# EAGLE design 506_outin_raspberrypi_zero (EAGLE 7.4.0)
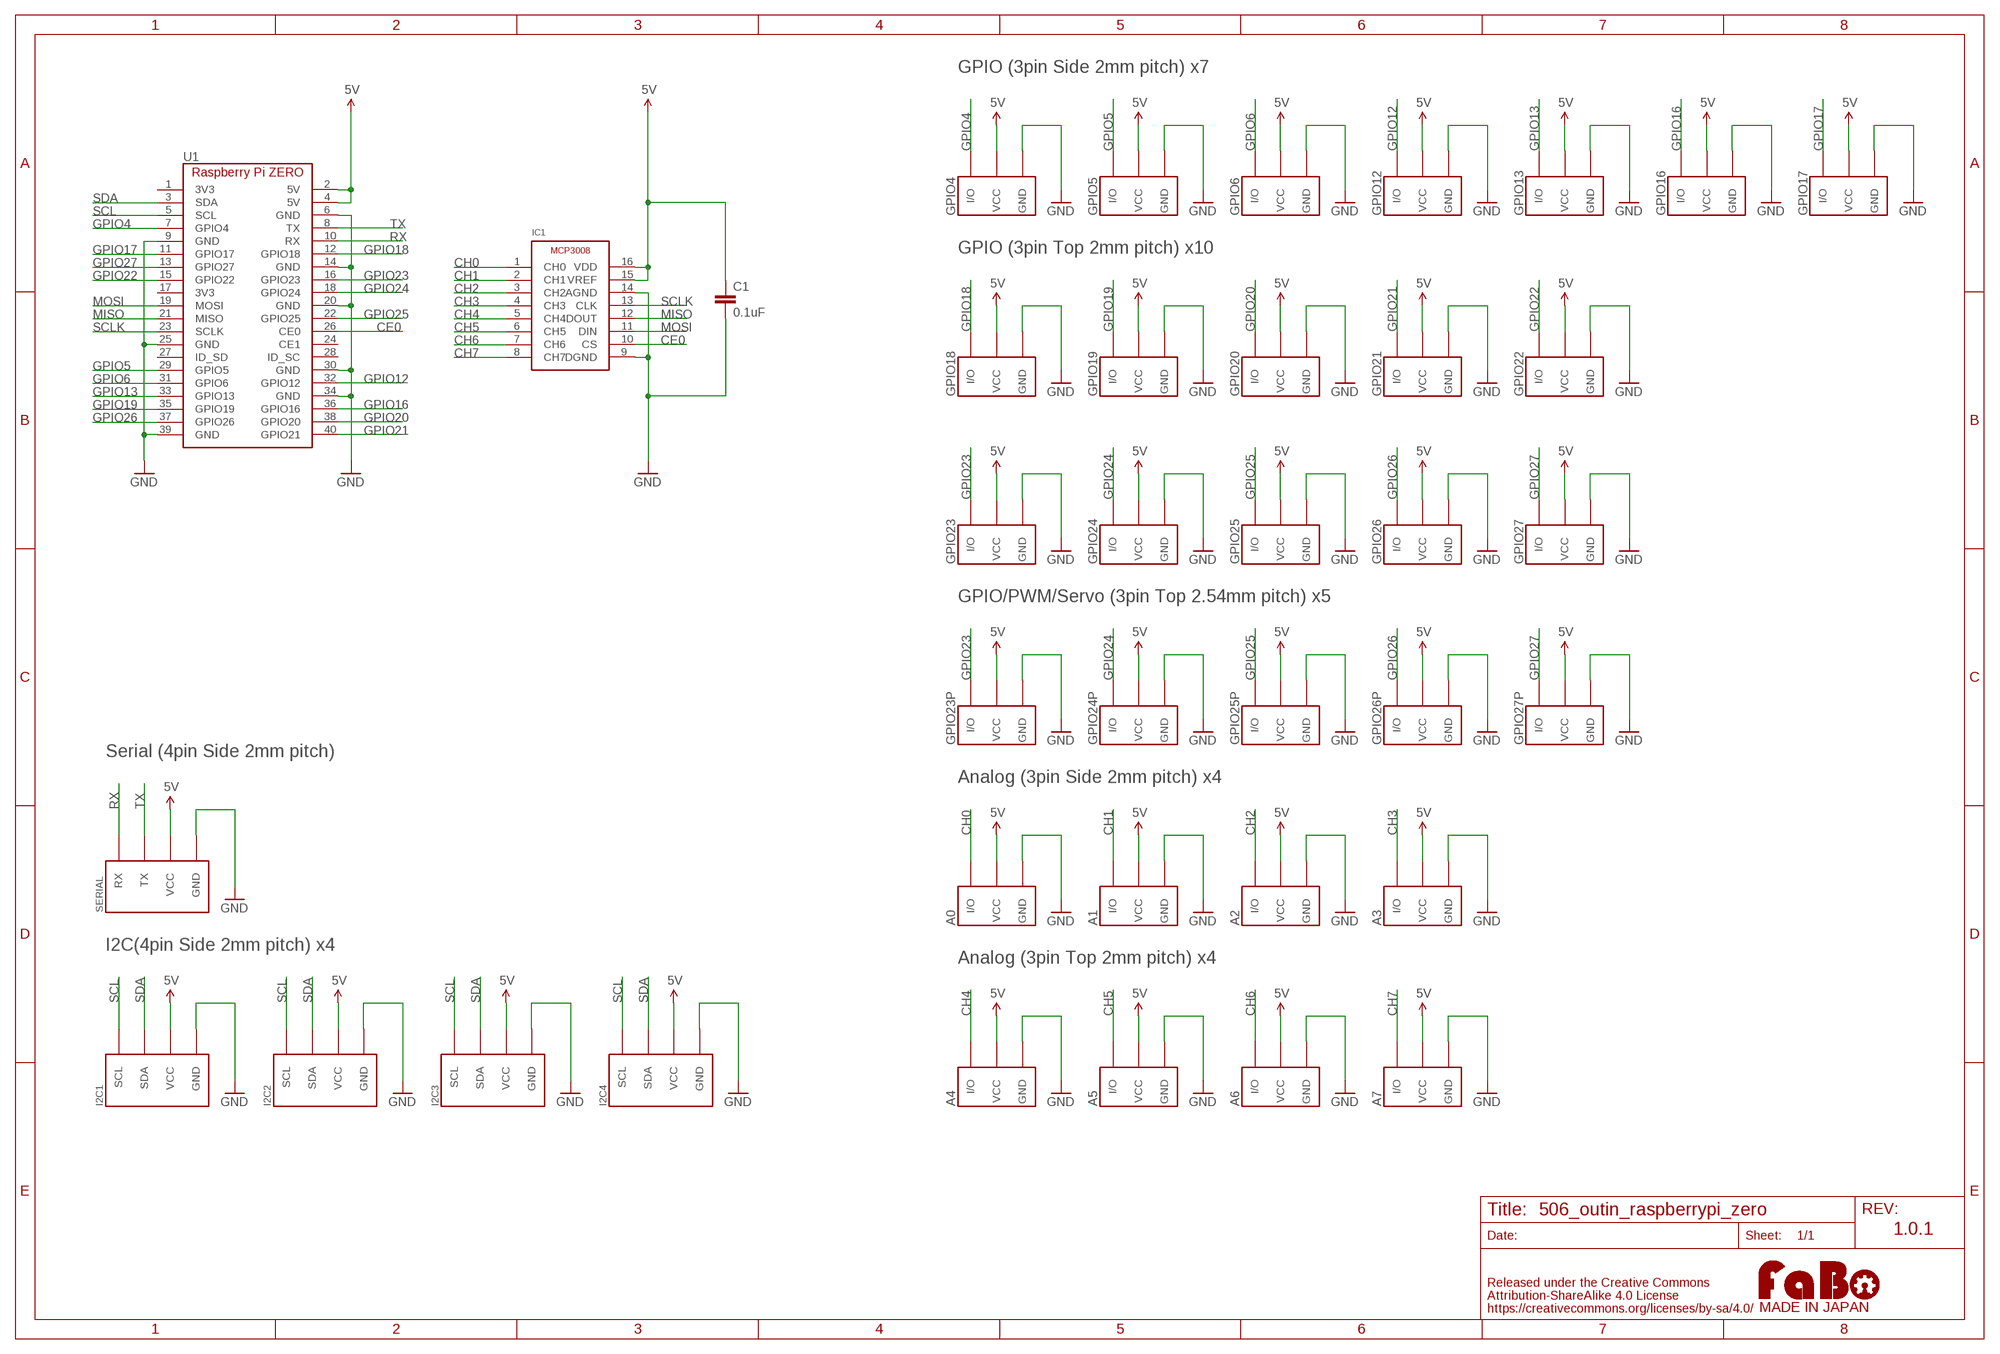
[diagram p0: schematic, sheet 1]

## Parts
A0  FABO_BRICK_3PIN-S03B-PASK-2  [FABO_BRICK_3PIN_S03B-PASK-2]
A1  FABO_BRICK_3PIN-S03B-PASK-2  [FABO_BRICK_3PIN_S03B-PASK-2]
A2  FABO_BRICK_3PIN-S03B-PASK-2  [FABO_BRICK_3PIN_S03B-PASK-2]
A3  FABO_BRICK_3PIN-S03B-PASK-2  [FABO_BRICK_3PIN_S03B-PASK-2]
A4  FABO_BRICK_3PIN-B03B-PASK-1  [FABO_BRICK_3PIN_B03B-PASK-1]
A5  FABO_BRICK_3PIN-B03B-PASK-1  [FABO_BRICK_3PIN_B03B-PASK-1]
A6  FABO_BRICK_3PIN-B03B-PASK-1  [FABO_BRICK_3PIN_B03B-PASK-1]
A7  FABO_BRICK_3PIN-B03B-PASK-1  [FABO_BRICK_3PIN_B03B-PASK-1]
C1  0.1uF  CAP-EIA0603  [EIA0603]
GPIO4  FABO_BRICK_3PIN-S03B-PASK-2  [FABO_BRICK_3PIN_S03B-PASK-2]
GPIO5  FABO_BRICK_3PIN-S03B-PASK-2  [FABO_BRICK_3PIN_S03B-PASK-2]
GPIO6  FABO_BRICK_3PIN-S03B-PASK-2  [FABO_BRICK_3PIN_S03B-PASK-2]
GPIO12  FABO_BRICK_3PIN-S03B-PASK-2  [FABO_BRICK_3PIN_S03B-PASK-2]
GPIO13  FABO_BRICK_3PIN-S03B-PASK-2  [FABO_BRICK_3PIN_S03B-PASK-2]
GPIO16  FABO_BRICK_3PIN-S03B-PASK-2  [FABO_BRICK_3PIN_S03B-PASK-2]
GPIO17  FABO_BRICK_3PIN-S03B-PASK-2  [FABO_BRICK_3PIN_S03B-PASK-2]
GPIO18  FABO_BRICK_3PIN-B03B-PASK-1  [FABO_BRICK_3PIN_B03B-PASK-1]
GPIO19  FABO_BRICK_3PIN-B03B-PASK-1  [FABO_BRICK_3PIN_B03B-PASK-1]
GPIO20  FABO_BRICK_3PIN-B03B-PASK-1  [FABO_BRICK_3PIN_B03B-PASK-1]
GPIO21  FABO_BRICK_3PIN-B03B-PASK-1  [FABO_BRICK_3PIN_B03B-PASK-1]
GPIO22  FABO_BRICK_3PIN-B03B-PASK-1  [FABO_BRICK_3PIN_B03B-PASK-1]
GPIO23  FABO_BRICK_3PIN-B03B-PASK-1  [FABO_BRICK_3PIN_B03B-PASK-1]
GPIO23P  FABO_BRICK_3PIN-HEADER  [FABO_BRICK_3PIN_HEADER]
GPIO24  FABO_BRICK_3PIN-B03B-PASK-1  [FABO_BRICK_3PIN_B03B-PASK-1]
GPIO24P  FABO_BRICK_3PIN-HEADER  [FABO_BRICK_3PIN_HEADER]
GPIO25  FABO_BRICK_3PIN-B03B-PASK-1  [FABO_BRICK_3PIN_B03B-PASK-1]
GPIO25P  FABO_BRICK_3PIN-HEADER  [FABO_BRICK_3PIN_HEADER]
GPIO26  FABO_BRICK_3PIN-B03B-PASK-1  [FABO_BRICK_3PIN_B03B-PASK-1]
GPIO26P  FABO_BRICK_3PIN-HEADER  [FABO_BRICK_3PIN_HEADER]
GPIO27  FABO_BRICK_3PIN-B03B-PASK-1  [FABO_BRICK_3PIN_B03B-PASK-1]
GPIO27P  FABO_BRICK_3PIN-HEADER  [FABO_BRICK_3PIN_HEADER]
I2C1  FABO_BRICK_I2C-S04B-PASK-2  [FABO_BRICK_I2C_S04B-PASK-2]
I2C2  FABO_BRICK_I2C-S04B-PASK-2  [FABO_BRICK_I2C_S04B-PASK-2]
I2C3  FABO_BRICK_I2C-S04B-PASK-2  [FABO_BRICK_I2C_S04B-PASK-2]
I2C4  FABO_BRICK_I2C-S04B-PASK-2  [FABO_BRICK_I2C_S04B-PASK-2]
IC1  MICROCHIP-MCP3008  [MICROCHIP-MCP3008]
SERIAL  FABO_BRICK_SERIAL-S04B-PASK-2  [FABO_BRICK_SERIAL_S04B-PASK-2]
U1  RASPBERRY_PI_ZERO  [RASPBERRY_PI_ZERO]
U$14  LOGO_FABO-M  [LOGO_FABO_MS]

## Nets
5V: A0.VCC A1.VCC A2.VCC A3.VCC A4.VCC A5.VCC A6.VCC A7.VCC C1.1 GPIO4.VCC GPIO5.VCC GPIO6.VCC GPIO12.VCC GPIO13.VCC GPIO16.VCC GPIO17.VCC GPIO18.VCC GPIO19.VCC GPIO20.VCC GPIO21.VCC GPIO22.VCC GPIO23.VCC GPIO23P.VCC GPIO24.VCC GPIO24P.VCC GPIO25.VCC GPIO25P.VCC GPIO26.VCC GPIO26P.VCC GPIO27.VCC GPIO27P.VCC I2C1.VCC I2C2.VCC I2C3.VCC I2C4.VCC IC1.15(VREF) IC1.16(VDD) SERIAL.VCC U1.2(5V) U1.4(5V)
CE0: IC1.10(CS) U1.26(CE0)
CH0: A0.I/O IC1.1(CH0)
CH1: A1.I/O IC1.2(CH1)
CH2: A2.I/O IC1.3(CH2)
CH3: A3.I/O IC1.4(CH3)
CH4: A4.I/O IC1.5(CH4)
CH5: A5.I/O IC1.6(CH5)
CH6: A6.I/O IC1.7(CH6)
CH7: A7.I/O IC1.8(CH7)
GND: A0.GND A1.GND A2.GND A3.GND A4.GND A5.GND A6.GND A7.GND C1.2 GPIO4.GND GPIO5.GND GPIO6.GND GPIO12.GND GPIO13.GND GPIO16.GND GPIO17.GND GPIO18.GND GPIO19.GND GPIO20.GND GPIO21.GND GPIO22.GND GPIO23.GND GPIO23P.GND GPIO24.GND GPIO24P.GND GPIO25.GND GPIO25P.GND GPIO26.GND GPIO26P.GND GPIO27.GND GPIO27P.GND I2C1.GND I2C2.GND I2C3.GND I2C4.GND IC1.9(DGND) IC1.14(AGND) SERIAL.GND U1.6(GND) U1.9(GND) U1.14(GND) U1.20(GND) U1.25(GND) U1.30(GND) U1.34(GND) U1.39(GND)
GPIO4: GPIO4.I/O U1.7(GPIO4)
GPIO5: GPIO5.I/O U1.29(GPIO5)
GPIO6: GPIO6.I/O U1.31(GPIO6)
GPIO12: GPIO12.I/O U1.32(GPIO12)
GPIO13: GPIO13.I/O U1.33(GPIO13)
GPIO16: GPIO16.I/O U1.36(GPIO16)
GPIO17: GPIO17.I/O U1.11(GPIO17)
GPIO18: GPIO18.I/O U1.12(GPIO18)
GPIO19: GPIO19.I/O U1.35(GPIO19)
GPIO20: GPIO20.I/O U1.38(GPIO20)
GPIO21: GPIO21.I/O U1.40(GPIO21)
GPIO22: GPIO22.I/O U1.15(GPIO22)
GPIO23: GPIO23.I/O GPIO23P.I/O U1.16(GPIO23)
GPIO24: GPIO24.I/O GPIO24P.I/O U1.18(GPIO24)
GPIO25: GPIO25.I/O GPIO25P.I/O U1.22(GPIO25)
GPIO26: GPIO26.I/O GPIO26P.I/O U1.37(GPIO26)
GPIO27: GPIO27.I/O GPIO27P.I/O U1.13(GPIO27)
MISO: IC1.12(DOUT) U1.21(MISO)
MOSI: IC1.11(DIN) U1.19(MOSI)
RX: SERIAL.RX U1.10(RX)
SCL: I2C1.SCL I2C2.SCL I2C3.SCL I2C4.SCL U1.5(SCL)
SCLK: IC1.13(CLK) U1.23(SCLK)
SDA: I2C1.SDA I2C2.SDA I2C3.SDA I2C4.SDA U1.3(SDA)
TX: SERIAL.TX U1.8(TX)
Unconnected: U1.1(3V3) U1.17(3V3) U1.24(CE1) U1.27(ID_SD) U1.28(ID_SC)

## Notes on the sheet
- GPIO (3pin Side 2mm pitch) x7
- GPIO (3pin Top 2mm pitch) x10
- GPIO/PWM/Servo (3pin Top 2.54mm pitch) x5
- Serial (4pin Side 2mm pitch)
- Analog (3pin Side 2mm pitch) x4
- I2C(4pin Side 2mm pitch) x4
- Analog (3pin Top 2mm pitch) x4
- 1.0.1

## Library data of the parts
A0 A1-A7 GPIO4-GPIO6 GPIO12 GPIO13 GPIO16-GPIO23 GPIO23P GPIO24 GPIO24P GPIO25 GPIO25P GPIO26 GPIO26P GPIO27 GPIO27P = FaBo-Template:FABO_BRICK_3PIN: FaBo Brick 3pin
C1 = FaBo-etc:CAP: Capacitor Standard 0603 ceramic capacitor
I2C1-I2C4 = FaBo-Template:FABO_BRICK_I2C: FaBo Brick I2C
IC1 = FaBo-ADC:MICROCHIP-MCP3008
SERIAL = FaBo-Template:FABO_BRICK_SERIAL: FaBo Brick Serial
U1 = FaBo-Boards:RASPBERRY_PI_ZERO
U$14 = FaBo-etc:LOGO_FABO

## Board
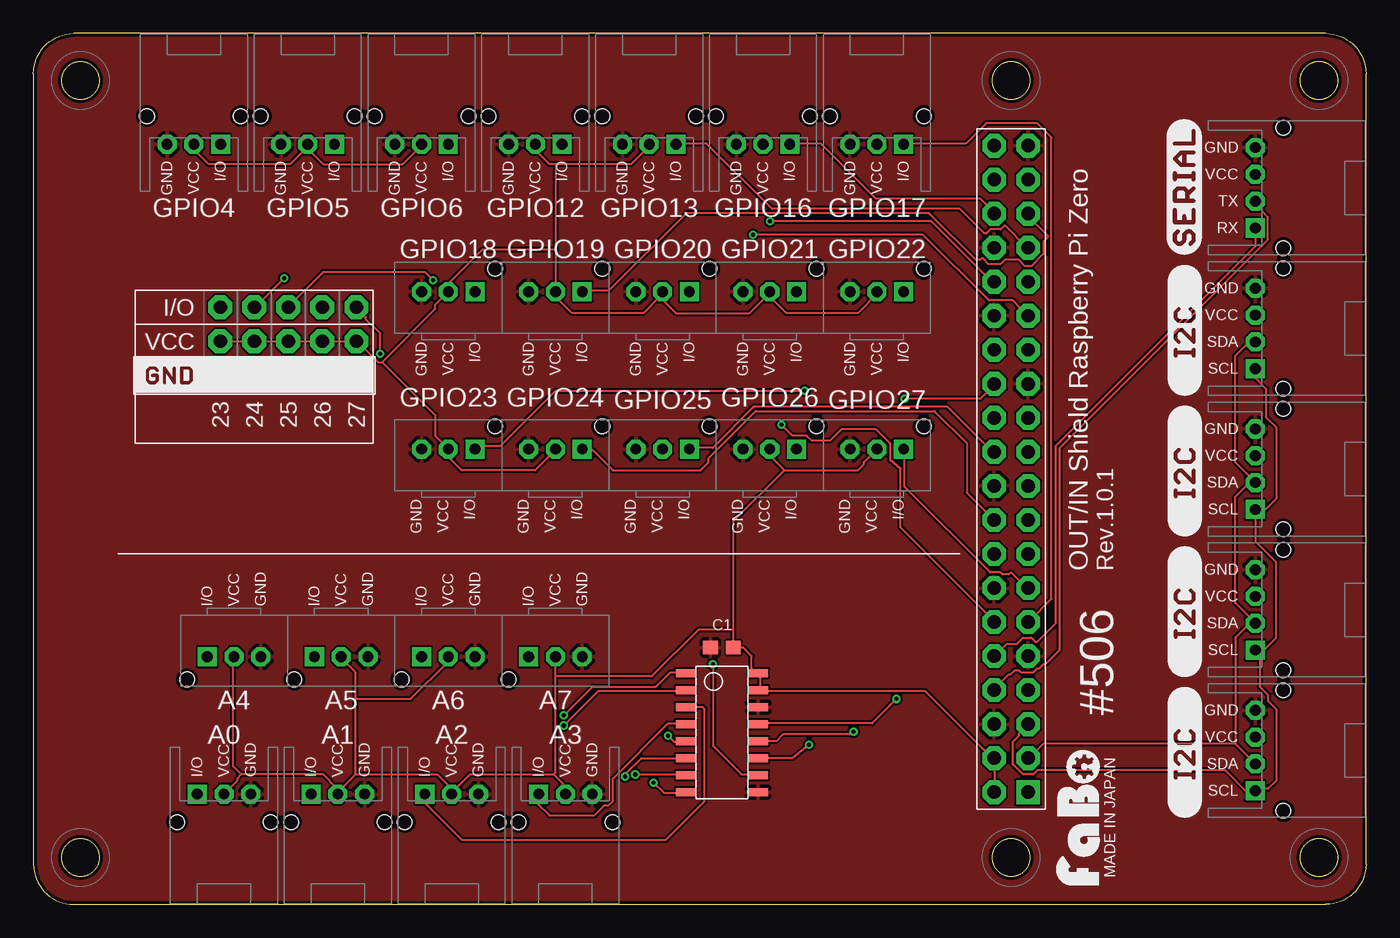
[diagram p1: board, top side]
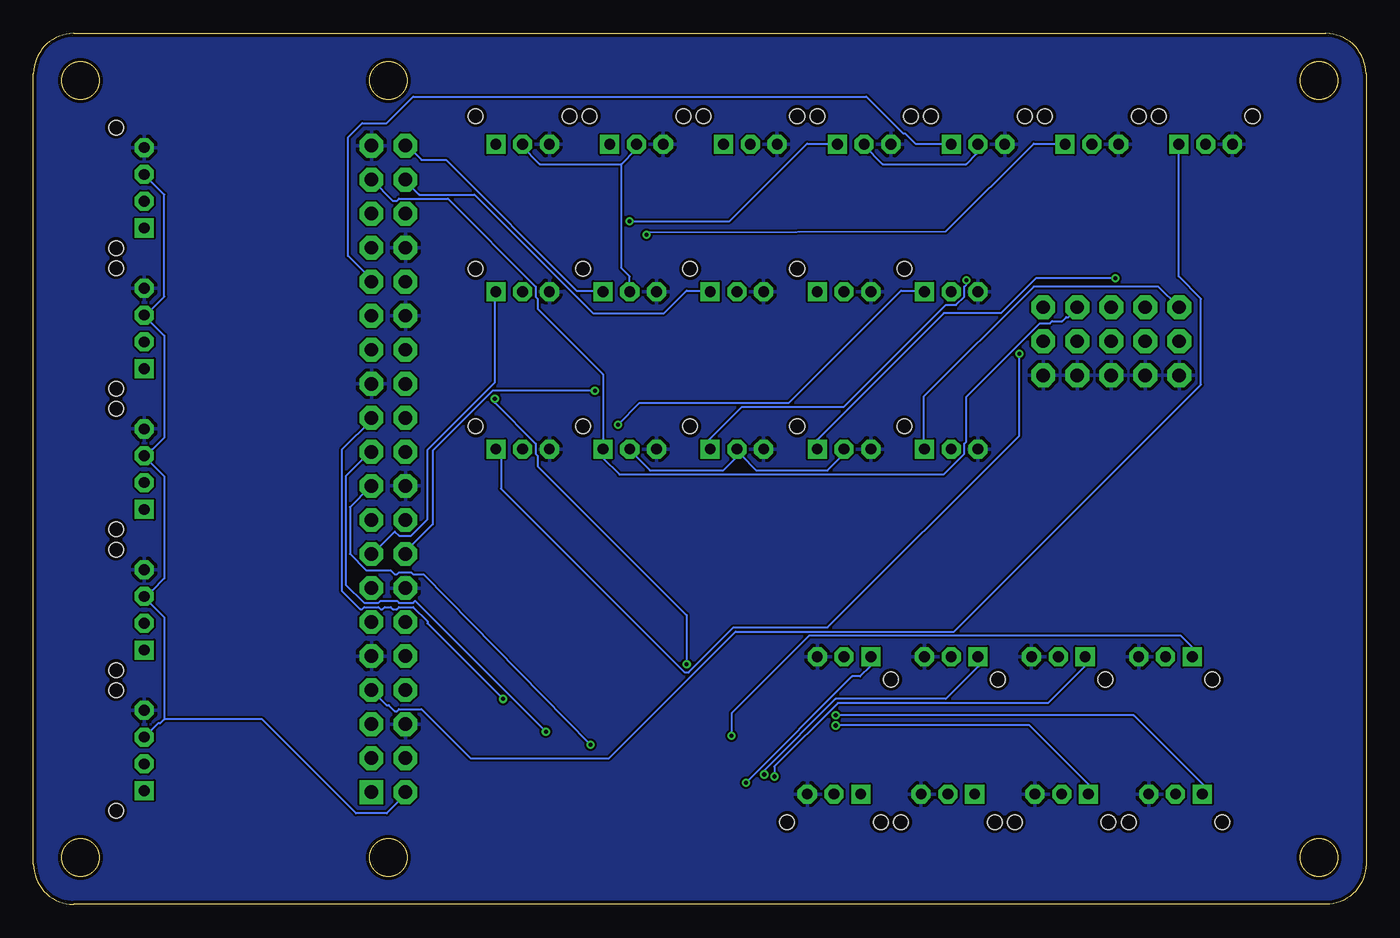
[diagram p2: board, bottom side, seen from below]

Size 99.5 x 65 mm. Coordinates in mm from the lower left corner, seen from the top.
Copper layers (1*16): Top 0.035mm / dielectric 1.5mm / Bottom 0.035mm
Design rules "Elecrow_2-layer_eagle_rule": minimum track width 6mil, minimum drill 12mil, track to track 6mil, track to pad 6mil, pad to pad 6mil, via to via 6mil, smd to smd 0mil, copper to edge 10mil, drill to drill 10mil, minimum pad ring 10mil, minimum via ring 6mil, stop-mask expansion 2mil, vias tented up to drill 100mil, thermal gap 10mil

### Footprints (pad centres in the part's own frame; a part is rotated, then mirrored left to right if it is on the bottom)
FABO_BRICK_3PIN_S03B-PASK-2 = drill 0.8 pad 1.422 octagon: GND -2,0; VCC 0,0 | drill 0.8 pad 1.422 square: I/O 2,0 | hole 1.1: 3.5,2.1; -3.5,2.1
FABO_BRICK_3PIN_B03B-PASK-1 = drill 0.8 pad 1.422 octagon: GND -2,0; VCC 0,0 | drill 0.8 pad 1.422 square: I/O 2,0 | hole 1.1: 3.5,1.7
EIA0603 = smd 1.1 x 1: 1 -0.85,0; 2 0.85,0
FABO_BRICK_3PIN_HEADER = drill 1 pad 1.778 octagon: GND -2.54,0; I/O 2.54,0; VCC 0,0
FABO_BRICK_I2C_S04B-PASK-2 = drill 0.8 pad 1.422 octagon: GND -3,0; SDA 1,0; VCC -1,0 | drill 0.8 pad 1.422 square: SCL 3,0 | hole 1.1: 4.5,2.1; -4.5,2.1
MICROCHIP-MCP3008 = smd 0.6 x 1.5: 1 -4.445,-2.7; 2 -3.175,-2.7; 3 -1.905,-2.7; 4 -0.635,-2.7; 5 0.635,-2.7; 6 1.905,-2.7; 7 3.175,-2.7; 8 4.445,-2.7; 9 4.445,2.7; 10 3.175,2.7; 11 1.905,2.7; 12 0.635,2.7; 13 -0.635,2.7; 14 -1.905,2.7; 15 -3.175,2.7; 16 -4.445,2.7
FABO_BRICK_SERIAL_S04B-PASK-2 = drill 0.8 pad 1.422 octagon: GND -3,0; TX 1,0; VCC -1,0 | drill 0.8 pad 1.422 square: RX 3,0 | hole 1.1: 4.5,2.1; -4.5,2.1
RASPBERRY_PI_ZERO = drill 1 pad 1.778 square: 1 -24.13,-1.27 | drill 1 pad 1.778 octagon: 2 -24.13,1.27; 3 -21.59,-1.27; 4 -21.59,1.27; 5 -19.05,-1.27; 6 -19.05,1.27; 7 -16.51,-1.27; 8 -16.51,1.27; 9 -13.97,-1.27; 10 -13.97,1.27; 11 -11.43,-1.27; 12 -11.43,1.27; 13 -8.89,-1.27; 14 -8.89,1.27; 15 -6.35,-1.27; 16 -6.35,1.27; 17 -3.81,-1.27; 18 -3.81,1.27; 19 -1.27,-1.27; 20 -1.27,1.27; 21 1.27,-1.27; 22 1.27,1.27; 23 3.81,-1.27; 24 3.81,1.27; 25 6.35,-1.27; 26 6.35,1.27; 27 8.89,-1.27; 28 8.89,1.27; 29 11.43,-1.27; 30 11.43,1.27; 31 13.97,-1.27; 32 13.97,1.27; 33 16.51,-1.27; 34 16.51,1.27; 35 19.05,-1.27; 36 19.05,1.27; 37 21.59,-1.27; 38 21.59,1.27; 39 24.13,-1.27; 40 24.13,1.27

### Placement (x,y rotation side)
A0  14.22,8.23 180 top
A1  22.72,8.23 180 top
A2  31.22,8.23 180 top
A3  39.72,8.23 180 top
A4  14.97,18.48 180 top
A5  22.97,18.48 180 top
A6  30.97,18.48 180 top
A7  38.97,18.48 180 top
C1  51.41,19.16 180 top
GPIO4  11.97,56.73 0 top
GPIO5  20.47,56.73 0 top
GPIO6  28.97,56.73 0 top
GPIO12  37.47,56.73 0 top
GPIO13  45.97,56.73 0 top
GPIO16  54.47,56.73 0 top
GPIO17  62.97,56.73 0 top
GPIO18  30.97,45.73 0 top
GPIO19  38.97,45.73 0 top
GPIO20  46.97,45.73 0 top
GPIO21  54.97,45.73 0 top
GPIO22  62.97,45.73 0 top
GPIO23  30.97,33.98 0 top
GPIO23P  13.94,42.02 90 top
GPIO24  38.97,33.98 0 top
GPIO24P  16.48,42.02 90 top
GPIO25  46.97,33.98 0 top
GPIO25P  19.02,42.02 90 top
GPIO26  54.97,33.98 0 top
GPIO26P  21.56,42.02 90 top
GPIO27  62.97,33.98 0 top
GPIO27P  24.1,42.02 90 top
I2C1  91.22,42.98 270 top
I2C2  91.22,32.48 270 top
I2C3  91.22,21.98 270 top
I2C4  91.22,11.48 270 top
IC1  51.41,12.81 270 top
SERIAL  91.22,53.48 270 top
U1  73,32.5 90 top
U$2  [LOGO_SILK_I2C]  87.22,16.98 90 top
U$3  [LOGO_SILK_SERIAL2]  87.22,48.48 90 top
U$5  [LOGO_SILK_I2C]  87.22,6.48 90 top
U$6  [LOGO_SILK_I2C]  87.22,27.48 90 top
U$7  [LOGO_SILK_I2C]  87.22,37.98 90 top
U$8  [LOGO_SILK_GND]  8.23,38.21 0 top
U$14  79.98,6.46 90 top

### Tracks (layer width: path | path; a pad name or v marks a point on that pad's centre or on a via)
5V
  Top 0.152: GPIO23P.VCC 14,42 16.43,42 GPIO24P.VCC 16.59,42 19.02,42 | 19.02,42 21.46,42 GPIO26P.VCC 21.62,42 24.05,42 GPIO27P.VCC 24.21,42 25.73,40.48 26.03,40.48 | 19.02,42 GPIO25P.VCC | GPIO24.VCC 38.99,33.92 37.46,32.4 31.98,32.4 31.06,33.31 31.06,33.92 GPIO23.VCC 30.91,34.07 30,34.99 30,36.51 26.03,40.48 | 26.03,40.48 30,44.44 30,44.74 30.91,45.66 GPIO18.VCC 31.06,45.81 31.06,46.42 33.5,48.86 38.99,48.86 | 20.4,56.48 20.55,56.63 GPIO5.VCC 20.4,56.48 | 20.4,56.48 19.18,55.26 13.08,55.26 12.01,56.32 12.01,56.63 GPIO4.VCC | 20.4,56.48 21.62,55.26 27.56,55.26 28.93,56.63 GPIO6.VCC | 54.99,45.35 54.99,45.66 GPIO21.VCC 54.99,45.35 | 54.99,45.35 56.21,44.13 61.54,44.13 63.07,45.66 GPIO22.VCC | 46.76,45.35 47.07,45.66 GPIO20.VCC 46.76,45.35 | 46.76,45.35 45.54,44.13 40.21,44.13 38.99,45.35 38.99,45.66 GPIO19.VCC 38.99,45.81 38.99,48.86 | 38.99,55.26 44.63,55.26 46,56.63 GPIO13.VCC | 38.99,55.26 38.53,55.26 37.62,56.17 37.62,56.63 GPIO12.VCC | 38.99,55.26 38.99,48.86 | 54.99,45.35 54.69,45.35 53.47,44.13 47.98,44.13 46.76,45.35 | 15.52,9.69 15.21,9.39 15.21,9.23 14.3,8.32 A0.VCC | 15.52,9.69 21.62,9.69 22.68,8.62 22.68,8.32 | 31.22,8.32 31.22,8.62 30.15,9.69 24.05,9.69 | 22.68,8.32 24.05,9.69 | 22.68,8.32 A1.VCC | 38.84,9.69 39.6,8.93 39.6,8.32 A3.VCC | 38.84,9.69 32.59,9.69 31.22,8.32 | 31.22,8.32 A2.VCC | 15.52,9.69 14.91,10.3 14.91,18.38 A4.VCC | 24.05,9.69 24.05,15.33 | 24.05,15.33 24.05,17.31 22.99,18.38 A5.VCC | 24.05,15.33 28.17,15.33 30.91,18.07 30.91,18.38 A6.VCC | 38.99,17.01 38.99,9.84 38.84,9.69 | 38.99,17.01 38.99,18.38 A7.VCC | U1.2 71.75,8.47 71.75,10.91 U1.4 71.6,10.91 66.57,15.94 54.23,15.94 IC1.15 54.23,16.09 54.23,17.16 IC1.16 54.08,17.16 53.62,17.62 53.62,18.53 53.01,19.14 52.4,19.14 C1.1 52.25,19.29 52.25,20.51
  Top 0.152: 56.06,32.4 61.54,32.4 62,32.86 62,33.01 62.92,33.92 GPIO27.VCC | 56.06,32.4 54.99,33.46 54.99,33.92 GPIO26.VCC | 52.25,20.51 52.25,28.59 56.06,32.4 | 38.99,17.01 46.15,17.01 49.66,20.51 52.25,20.51
  Bottom 0.152: 55.6,55.26 54.53,56.32 54.53,56.63 GPIO16.VCC | 55.6,55.26 61.7,55.26 63.07,56.63 GPIO17.VCC | 55.6,55.26 55.6,47.49 54.99,46.88 54.99,45.81 GPIO21.VCC | GPIO6.VCC 29.08,56.63 29.08,56.02 29.84,55.26 36.09,55.26 37.46,56.63 GPIO12.VCC | 89.74,13.81 90.04,13.5 90.2,13.5 91.11,12.59 I2C4.VCC | 89.74,13.81 89.74,21.43 91.26,22.95 I2C3.VCC 91.11,23.1 90.8,23.41 90.65,23.41 89.74,24.32 89.74,31.94 91.26,33.46 I2C2.VCC 91.11,33.62 90.8,33.92 90.65,33.92 89.74,34.84 89.74,42.46 91.11,43.83 I2C1.VCC 91.11,43.98 89.74,45.35 89.74,52.97 91.11,54.34 SERIAL.VCC | 47.07,33.46 47.07,33.31 47.98,32.4 53.47,32.4 54.99,33.92 GPIO26.VCC | 47.07,33.46 47.07,33.92 GPIO25.VCC 47.07,33.46 | 89.74,13.81 82.42,13.81 75.41,6.79 73.13,6.79 71.6,8.32 U1.2 | 47.07,33.46 46.61,33.46 45.54,32.4 40.21,32.4 38.99,33.62 38.99,33.92 GPIO24.VCC
CE0  (via drill 0.3)
  Top 0.152: v50.72,17.92 50.72,11.82 52.86,9.69 54.08,9.69 IC1.10 | v65.05,37.73 70.69,37.73 71.75,38.8 U1.26
  Bottom 0.152: v50.72,17.92 50.72,21.58 61.85,32.7 61.85,33.46 62,33.62 62,34.38 65.05,37.43 v65.05,37.73
CH0  (via drill 0.3)
  Top 0.152: v39.6,14.11 41.73,16.24 46.48,16.24 47.55,17.31 48.59,17.31 IC1.1
  Bottom 0.152: v39.6,14.11 17.35,14.11 12.17,8.93 12.17,8.32 A0.I/O
CH1  (via drill 0.3)
  Top 0.152: v39.6,13.35 42.19,15.94 48.59,15.94 IC1.2
  Bottom 0.152: v39.6,13.35 25.12,13.35 20.7,8.93 20.7,8.32 A1.I/O
CH2
  Top 0.152: IC1.3 49.96,14.72 50.11,14.57 50.11,7.71 47.22,4.81 31.98,4.81 29.24,7.56 29.24,8.17 A2.I/O
CH3
  Top 0.152: IC1.4 48.59,13.5 47.37,13.5 43.26,9.39 43.26,7.71 42.95,7.4 42.65,7.4 41.88,6.64 38.53,6.64 37.62,7.56 37.62,8.17 A3.I/O
CH4  (via drill 0.3)
  Top 0.152: v47.37,12.59 47.83,12.13 48.59,12.13 IC1.5
  Bottom 0.152: v47.37,12.59 47.37,14.26 41.58,20.05 13.84,20.05 12.93,19.14 12.93,18.53 A4.I/O
CH5  (via drill 0.3)
  Top 0.152: IC1.6 45.39,10.91 44.17,9.69 v44.17,9.54
  Bottom 0.152: v44.17,9.54 44.17,10.3 39.45,15.02 23.75,15.02 21.01,17.77 21.01,18.38 A5.I/O
CH6  (via drill 0.3)
  Top 0.152: v44.93,9.69 48.59,9.69 IC1.7
  Bottom 0.152: v44.93,9.69 44.93,10 39.6,15.33 31.37,15.33 28.93,17.77 28.93,18.38 A6.I/O
CH7  (via drill 0.3)
  Top 0.152: v46.3,9.08 47.07,8.32 48.59,8.32 IC1.8
  Bottom 0.152: v46.3,9.08 38.38,17.01 37.77,17.01 37.01,17.77 37.01,18.38 A7.I/O
GND
  pour Bottom: -1.3,-1.79 100.94,-1.79 100.94,66.79 -1.3,66.79
  pour Top: -1.3,-1.79 100.94,-1.79 100.94,66.79 -1.3,66.79
GPIO4
  Bottom 0.152: GPIO4.I/O 14,56.63 14,46.88 12.32,45.2 12.32,38.8 30.76,20.36 47.07,20.36 56.51,10.91 66.88,10.91 70.54,14.57 72.21,14.57 72.36,14.41 72.52,14.41 72.97,14.87 73.13,14.87 74.19,15.94 U1.7
GPIO5  (via drill 0.3)
  Top 0.152: v53.72,49.97 66.42,49.97 71.35,45.07 73.13,45.07 74.19,43.98 U1.29
  Bottom 0.152: v53.72,49.97 53.7,50.03 53.57,50.15 31.37,50.23 24.82,56.78 22.53,56.78 GPIO5.I/O
GPIO6
  Bottom 0.152: GPIO6.I/O 31.06,56.78 33.65,56.78 34.42,57.54 34.57,57.54 37.31,60.29 71.15,60.29 73.13,58.31 74.96,58.31 76.02,57.24 76.02,48.4 74.19,46.57 U1.31
GPIO12  (via drill 0.3)
  Top 0.152: v54.99,50.99 67.03,50.99 71.6,46.42 U1.32
  Bottom 0.152: v54.99,50.99 47.52,50.99 41.73,56.78 39.6,56.78 GPIO12.I/O
GPIO13
  Top 0.152: GPIO13.I/O 47.98,56.78 50.27,56.78 55.14,51.91 69.16,51.91 70.99,50.08 71.15,50.08 71.45,50.38 72.21,50.38 72.52,50.69 74.19,49.01 U1.33
GPIO16
  Top 0.152: GPIO16.I/O 56.51,56.78 58.8,56.78 62.92,52.67 70.69,52.67 71.75,51.6 U1.36
GPIO17
  Top 0.152: GPIO17.I/O 65.05,56.78 69.62,56.78 71.15,58.31 74.96,58.31 76.02,57.24 76.02,22.8 74.35,21.12 U1.11
GPIO18  (via drill 0.3)
  Top 0.152: v55.85,35.8 56.67,34.99 57.73,34.99 58.12,34.61 59.49,34.61 60.32,35.45 62.92,35.45 63.98,34.38 63.98,33.13 64.74,32.52 64.74,28.13 71.75,21.12 U1.12
  Bottom 0.152: v55.85,35.8 54.23,37.43 43.1,37.43 34.72,45.81 33.05,45.81 GPIO18.I/O
GPIO19
  Top 0.152: GPIO19.I/O 41.12,45.81 42.95,45.81 48.74,51.6 66.88,51.6 70.38,48.1 70.69,48.1 70.84,48.25 71.3,47.79 72.21,47.79 72.52,48.1 73.58,48.1 74.04,47.64 74.5,47.64 75.41,48.55 75.41,49.47 75.72,49.77 75.72,49.92 74.19,51.45 U1.35
GPIO20
  Bottom 0.152: GPIO20.I/O 49.05,45.81 50.72,45.81 52.4,44.13 57.73,44.13 66.57,52.97 70.69,52.97 71.75,54.04 U1.38
GPIO21
  Bottom 0.152: GPIO21.I/O 57.12,45.81 58.95,45.81 68.71,55.56 70.54,55.56 71.6,56.63 U1.40
GPIO22
  Bottom 0.152: GPIO22.I/O 65.05,45.66 65.05,38.95 70.08,33.92 70.08,28.74 71.3,27.52 72.21,27.52 72.52,27.83 74.19,26.15 U1.15
GPIO23  (via drill 0.3)
  Top 0.152: v57.58,38.34 38.99,38.34 34.87,34.23 33.2,34.23 33.05,34.07 GPIO23.I/O
  Bottom 0.152: GPIO23.I/O 33.05,34.07 33.05,37.88 24.82,46.11 15.52,46.11 14,44.59 GPIO23P.I/O | v57.58,38.34 65.2,38.34 69.7,33.85 69.7,28.36 71.6,26.45 71.6,26.15 U1.16
GPIO24  (via drill 0.3)
  Top 0.152: v18.72,46.72 16.59,44.59 GPIO24P.I/O | U1.18 69.7,30.72 69.7,34.4 67.28,36.82 53.92,36.82 50.42,33.31 50.42,33.01 49.81,32.4 43.26,32.4 41.73,33.92 41.12,33.92 GPIO24.I/O
  Bottom 0.152: v18.72,46.72 24.66,46.72 27.25,44.13 31.52,44.13 40.97,34.68 40.97,34.07 GPIO24.I/O
GPIO25  (via drill 0.3)
  Top 0.152: GPIO25.I/O 49.05,34.07 50.72,34.07 53.77,37.12 68.25,37.12 71.6,33.77 U1.22 | v29.84,46.57 29.24,47.18 21.62,47.18 19.02,44.59 GPIO25P.I/O
  Bottom 0.152: v29.84,46.57 29.69,46.42 30,46.11 30,45.35 30.61,44.74 31.37,44.74 38.99,37.12 46.61,37.12 49.05,34.68 49.05,34.07 GPIO25.I/O
GPIO26
  Bottom 0.152: U1.37 74.19,54.04 72.67,52.51 72.36,52.51 72.21,52.67 68.55,52.67 62,46.11 62,45.35 61.85,45.2 61.85,44.44 56.97,39.56 56.97,34.07 GPIO26.I/O 56.97,33.92 56.97,33.31 55.75,32.09 31.52,32.09 30,33.62 30,34.38 29.84,34.53 29.84,37.88 24.36,43.37 23.6,43.37 23.44,43.52 22.68,43.52 22.38,43.83 22.22,43.83 21.62,44.44 GPIO26P.I/O
GPIO27  (via drill 0.3)
  Top 0.152: GPIO27.I/O 65.05,33.92 65.05,31.18 71.45,24.78 72.21,24.78 72.36,24.63 72.82,24.63 72.97,24.78 74.19,23.56 U1.13 | v25.88,41.08 25.88,42.61 24.82,43.68 24.82,43.83 24.21,44.44 GPIO27P.I/O
  Bottom 0.152: v25.88,41.08 25.88,34.99 40.21,20.66 47.22,20.66 50.57,17.31 50.88,17.31 64.59,31.03 64.59,33.62 64.9,33.92 GPIO27.I/O
MISO  (via drill 0.3)
  Top 0.152: v61.24,12.89 60.93,12.69 55.98,12.69 55.47,12.18 54.46,12.18 54.23,12.13 IC1.12
  Bottom 0.152: v61.24,12.89 70.99,22.64 71.15,22.49 72.21,22.49 72.36,22.64 73.58,22.64 73.74,22.49 74.8,22.49 76.17,23.86 76.17,31.94 74.35,33.77 U1.21
MOSI  (via drill 0.3)
  Top 0.152: IC1.11 56.67,10.91 v57.91,11.9
  Bottom 0.152: v57.91,11.9 70.38,24.63 71.15,24.63 71.3,24.78 72.21,24.78 72.36,24.63 72.52,24.63 72.82,24.93 74.65,24.93 75.87,26.15 75.87,29.65 74.35,31.18 U1.19
RX
  Top 0.152: SERIAL.RX 91.26,50.38 91.26,49.16 76.33,34.23 76.33,20.97 74.96,19.6 74.8,19.6 74.5,19.9 73.89,19.9 73.43,19.44 72.67,19.44 71.75,18.53 U1.10
SCL
  Top 0.152: I2C1.SCL 91.26,39.87 91.26,39.26 92.02,38.49 92.02,36.36 92.79,35.6 92.79,30.26 92.02,29.5 91.26,29.5 I2C2.SCL 91.26,29.35 91.26,27.06 92.79,25.54 92.79,19.9 91.57,18.68 91.41,18.68 | 91.41,18.68 91.26,18.83 I2C3.SCL 91.41,18.68 | 91.41,18.68 91.57,18.53 91.57,16.24 92.18,15.63 92.18,15.18 92.79,14.57 92.79,9.23 92.18,8.62 91.26,8.62 I2C4.SCL 91.11,8.47 90.5,8.47 88.98,10 74.96,10 74.65,9.69 73.89,9.69 73.13,10.45 73.13,12.13 73.58,12.59 73.58,12.74 74.19,13.35 U1.5
SCLK  (via drill 0.3)
  Top 0.152: v64.44,15.33 62.61,13.5 54.23,13.5 IC1.13
  Bottom 0.152: v64.44,15.33 70.08,20.97 70.08,21.12 71.15,22.19 72.21,22.19 72.36,22.03 72.67,22.03 72.82,22.19 73.28,22.19 73.43,22.03 73.58,22.03 73.74,22.19 74.8,22.19 74.96,22.03 75.11,22.03 76.48,23.41 76.48,33.92 74.19,36.21 U1.23
SDA
  Top 0.152: 89.74,11.98 91.11,10.6 I2C4.SDA | 89.74,11.98 89.74,19.9 90.8,20.97 91.11,20.97 I2C3.SDA 91.11,21.12 89.74,22.49 89.74,30.42 90.65,31.33 91.11,31.33 I2C2.SDA 91.26,31.48 89.74,33.01 89.74,40.93 90.65,41.85 91.11,41.85 I2C1.SDA | 89.74,11.98 75.41,11.98 74.35,10.91 U1.3
TX
  Top 0.152: SERIAL.TX 91.26,52.36 91.72,51.91 91.72,51.75 92.18,51.3 92.18,49.62 76.63,34.07 76.63,18.99 75.56,17.92 75.41,17.92 75.11,17.62 74.96,17.62 74.65,17.31 73.74,17.31 73.58,17.46 73.28,17.46 72.97,17.16 72.82,17.16 71.75,16.09 U1.8

### Text on the board
tPlace: GND | GND | VCC | I/O | GND | VCC | I/O | GND | VCC | I/O | GND | VCC | I/O | GND | VCC | I/O | GND | VCC | I/O | GND | VCC | I/O | VCC | TX | RX | GND | I/O | VCC | VCC | GND | VCC | I/O | GND | VCC | I/O | GND | VCC | I/O | GND | VCC | I/O | GND | VCC | I/O | SDA | SCL | 23 | 24 | 25 | 26 | 27 | GND | VCC | SDA | GND | VCC | I/O | GND | VCC | I/O | GND | VCC | I/O | GND | VCC | I/O | GND | VCC | I/O | SCL | GND | OUT/IN Shield Raspberry Pi Zero | Rev.1.0.1 | VCC | I/O | VCC | GND | I/O | VCC | GND | I/O | VCC | GND | I/O | VCC | GND | SDA | SCL | #506 | GND | VCC | SDA | I/O | VCC | GND | I/O | VCC | GND | I/O | VCC | GND | I/O | VCC | GND | SCL | MADE IN JAPAN